# EAGLE design dht11 (EAGLE 8.3.1)
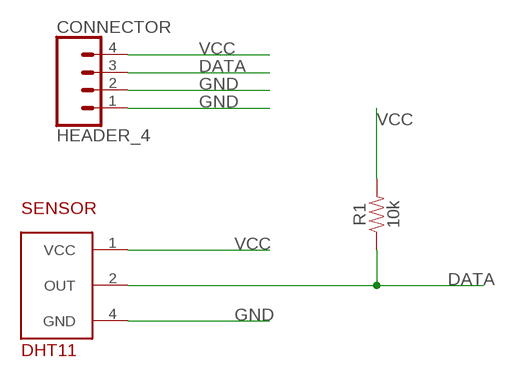
[diagram p0: schematic, sheet 1]

## Parts
CONNECTOR  HEADER_4  CONN_04POLAR  [MOLEX-1X4]
R1  10k  10KOHM-HORIZ-1/4W-1%  [AXIAL-0.3]
SENSOR  DHT11  [DHT11]

## Nets
DATA: CONNECTOR.3 R1.P$1 SENSOR.2(OUT)
GND: CONNECTOR.1 CONNECTOR.2 SENSOR.4(GND)
VCC: CONNECTOR.4 R1.P$2 SENSOR.1(VCC)

## Library data of the parts
CONNECTOR = SparkFun-Connectors:CONN_04: Multi connection point. Often used as Generic Header-pin footprint for 0.1 inch spaced/style header connections On any of the 0.1 inch spaced packages, you can populate with these: Break Away Headers - Straight <https://www.sparkfun.com/products/116> (PRT-00116) Break Away Male Headers - Right Angle <https://www.sparkfun.com/products/553> (PRT-00553) Female Headers <https://www.sparkfun.com/products/115> (PRT-00115) Break Away Headers - Machine Pin <https://www.sparkfun.com/products/117> (PRT-00117) Break Away Female Headers - Swiss Machine Pin <https://www.sparkfun.com/products/743> (PRT-00743) For SCREWTERMINALS and SPRING TERMINALS visit here: Screw Terimnals on SparkFun.com <https://www.sparkfun.com/search/results?term=Screw+Terminals> (5mm/3.5mm/2.54mm spacing) This device is also useful as a general connection point to wire up your design to another part of your project. Our various solder wires solder well into these plated through hole pads. Hook-Up Wire - Assortment (Stranded, 22 AWG) <https://www.sparkfun.com/products/11375> (PRT-11375) Hook-Up Wire - Assortment (Solid Core, 22 AWG) <https://www.sparkfun.com/products/11367> (PRT-11367) View the entire wire category on our website here <https://www.sparkfun.com/categories/141> Special notes: Molex polarized connector foot print use with SKU : PRT-08231 with associated crimp pins and housings. 1MM SMD Version SKU: PRT-10208; PROD_ID: CONN-08186; SF_ID: PRT-08231
R1 = SparkFun-Resistors:10KOHM: 10kΩ resistor A resistor is a passive two-terminal electrical component that implements electrical resistance as a circuit element. Resistors act to reduce current flow, and, at the same time, act to lower voltage levels within circuits. - Wikipedia; PROD_ID: RES-12183
SENSOR = parts:DHT11

## Board
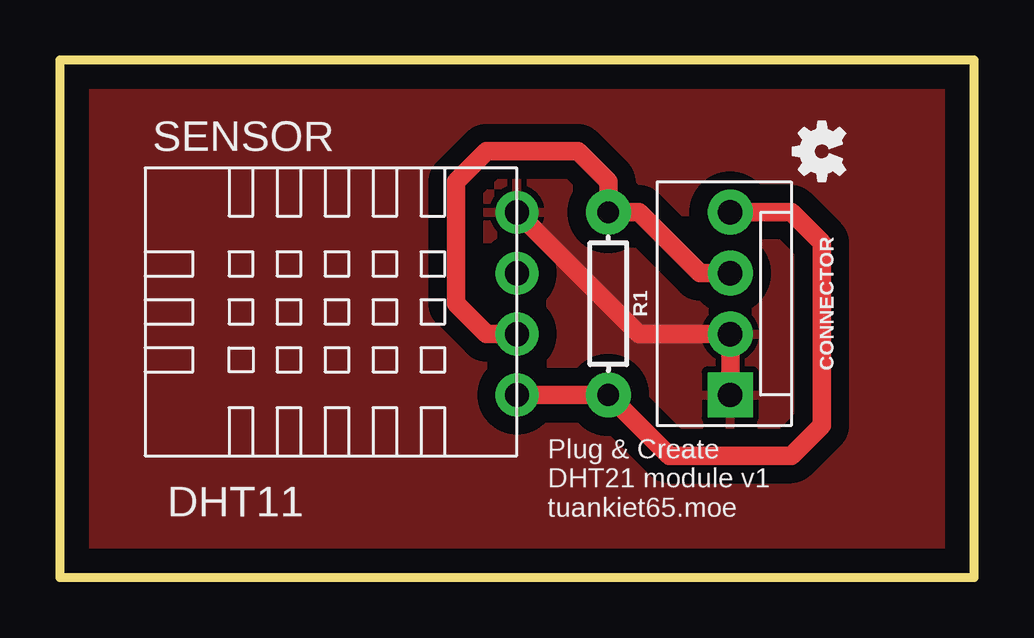
[diagram p1: board, top side]

Size 38.1 x 21.59 mm. Coordinates in mm from the lower left corner, seen from the top.
Outline: 38.1,21.59 38.1,0 0,0 0,21.59 38.1,21.59
Copper layers (1*16): Top 0.035mm / dielectric 1.5mm / Bottom 0.035mm
Design rules "default": minimum track width 10mil, minimum drill 24mil, track to track 8mil, track to pad 8mil, pad to pad 8mil, via to via 8mil, smd to smd 8mil, copper to edge 40mil, drill to drill 8mil, minimum pad ring 10mil, minimum via ring 8mil, stop-mask expansion 4mil, vias tented up to drill 0mil, thermal gap 10mil

### Footprints (pad centres in the part's own frame; a part is rotated, then mirrored left to right if it is on the bottom)
MOLEX-1X4 = drill 1.016 pad 1.88 square: 1 0,0 | drill 1.016 pad 1.88: 2 2.54,0; 3 5.08,0; 4 7.62,0
AXIAL-0.3 = drill 0.9 pad 1.88: P$1 -3.81,0; P$2 3.81,0
DHT11 = drill 1.016 pad 1.778: 1 2.54,0; 2 5.08,0; 3 7.62,0; 4 10.16,0

### Placement (x,y rotation side)
CONNECTOR  27.94,7.62 90 top
R1  22.86,11.43 270 top
SENSOR  19.05,5.08 90 top
U$1  [OSHW-LOGO-MINI]  31.75,17.78 90 top

### Tracks (layer width: path | path; a pad name or v marks a point on that pad's centre or on a via)
DATA
  Top 0.762: CONNECTOR.3 26.67,12.7 24.13,15.24 R1.P$1 22.86,16.51 21.59,17.78 17.78,17.78 16.51,16.51 16.51,11.43 17.78,10.16 SENSOR.2
GND
  Top 0.762: 27.94,9.8 CONNECTOR.1 | 27.94,9.8 CONNECTOR.2 | SENSOR.4 24.13,10.16 27.58,10.16 27.94,9.8
  pour Top (isolate 0.762): 0,0 38.1,0 38.1,21.59 0,21.59
VCC
  Top 0.762: SENSOR.1 R1.P$2 25.4,5.08 30.48,5.08 31.75,6.35 31.75,13.97 30.48,15.24 CONNECTOR.4

### Text on the board
tPlace: Plug & Create / DHT21 module v1 / tuankiet65.moe